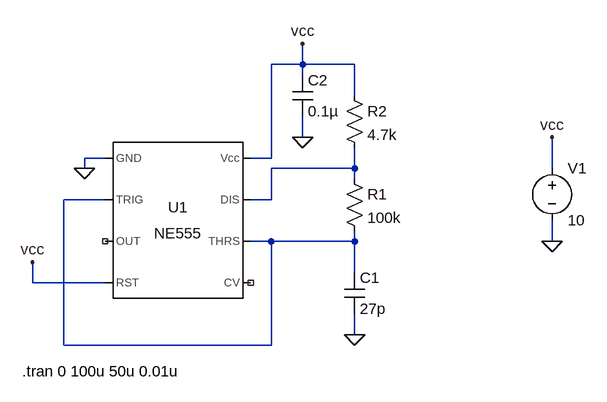
[diagram p0: schematic triangle_oscillator.asc]
triangle_oscillator.asc, the LTspice schematic file:
Version 4
SHEET 1 880 680
WIRE 400 -64 400 -96
WIRE 400 -64 352 -64
WIRE 480 -64 400 -64
WIRE 400 -48 400 -64
WIRE 480 -16 480 -64
WIRE 400 48 400 16
WIRE 96 80 64 80
WIRE 352 80 352 -64
WIRE 352 80 320 80
WIRE 64 96 64 80
WIRE 480 96 480 64
WIRE 480 96 352 96
WIRE 784 96 784 48
WIRE 480 112 480 96
WIRE 96 144 32 144
WIRE 352 144 352 96
WIRE 352 144 320 144
WIRE 352 208 320 208
WIRE 480 208 480 192
WIRE 480 208 352 208
WIRE 784 208 784 176
WIRE 480 256 480 208
WIRE -16 272 -16 240
WIRE 96 272 -16 272
WIRE 480 352 480 320
WIRE 32 368 32 144
WIRE 352 368 352 208
WIRE 352 368 32 368
FLAG 480 352 0
FLAG 64 96 0
FLAG 400 48 0
FLAG 400 -96 vcc
FLAG -16 240 vcc
FLAG 784 208 0
FLAG 784 48 vcc
SYMBOL Misc\\NE555 208 176 R0
SYMATTR InstName U1
SYMBOL cap 464 256 R0
SYMATTR InstName C1
SYMATTR Value 27p
SYMATTR SpiceLine V=50 Irms=0 Rser=0 Lser=0 mfg="Murata" pn="GRM0335C1H270JA01" type="C0G"
SYMBOL res 464 96 R0
SYMATTR InstName R1
SYMATTR Value 100k
SYMATTR SpiceLine tol=0.1 pwr=100m
SYMBOL res 464 -32 R0
SYMATTR InstName R2
SYMATTR Value 4.7k
SYMATTR SpiceLine tol=0.1 pwr=100m
SYMBOL cap 384 -48 R0
SYMATTR InstName C2
SYMATTR Value 0.1µ
SYMBOL voltage 784 80 R0
WINDOW 123 0 0 Left 0
WINDOW 39 0 0 Left 0
SYMATTR InstName V1
SYMATTR Value 10
TEXT -32 408 Left 2 !.tran 0 100u 50u 0.01u

The netlist it stands for:
* triangle_oscillator.asc
XU1 0 N002 NC_01 vcc NC_02 N002 N001 vcc NE555  ; pins GND TRIG OUT RST CV THRS DIS Vcc
C1 N002 0 27p V=50 Irms=0 Rser=0 Lser=0 mfg="Murata" pn="GRM0335C1H270JA01" type="C0G"
R1 N001 N002 100k tol=0.1 pwr=100m
R2 vcc N001 4.7k tol=0.1 pwr=100m
C2 vcc 0 0.1µ
V1 vcc 0 10
.tran 0 100u 50u 0.01u
.lib NE555.sub
.backanno
.end